# EAGLE design Ram_Upgrade (EAGLE 6.4)
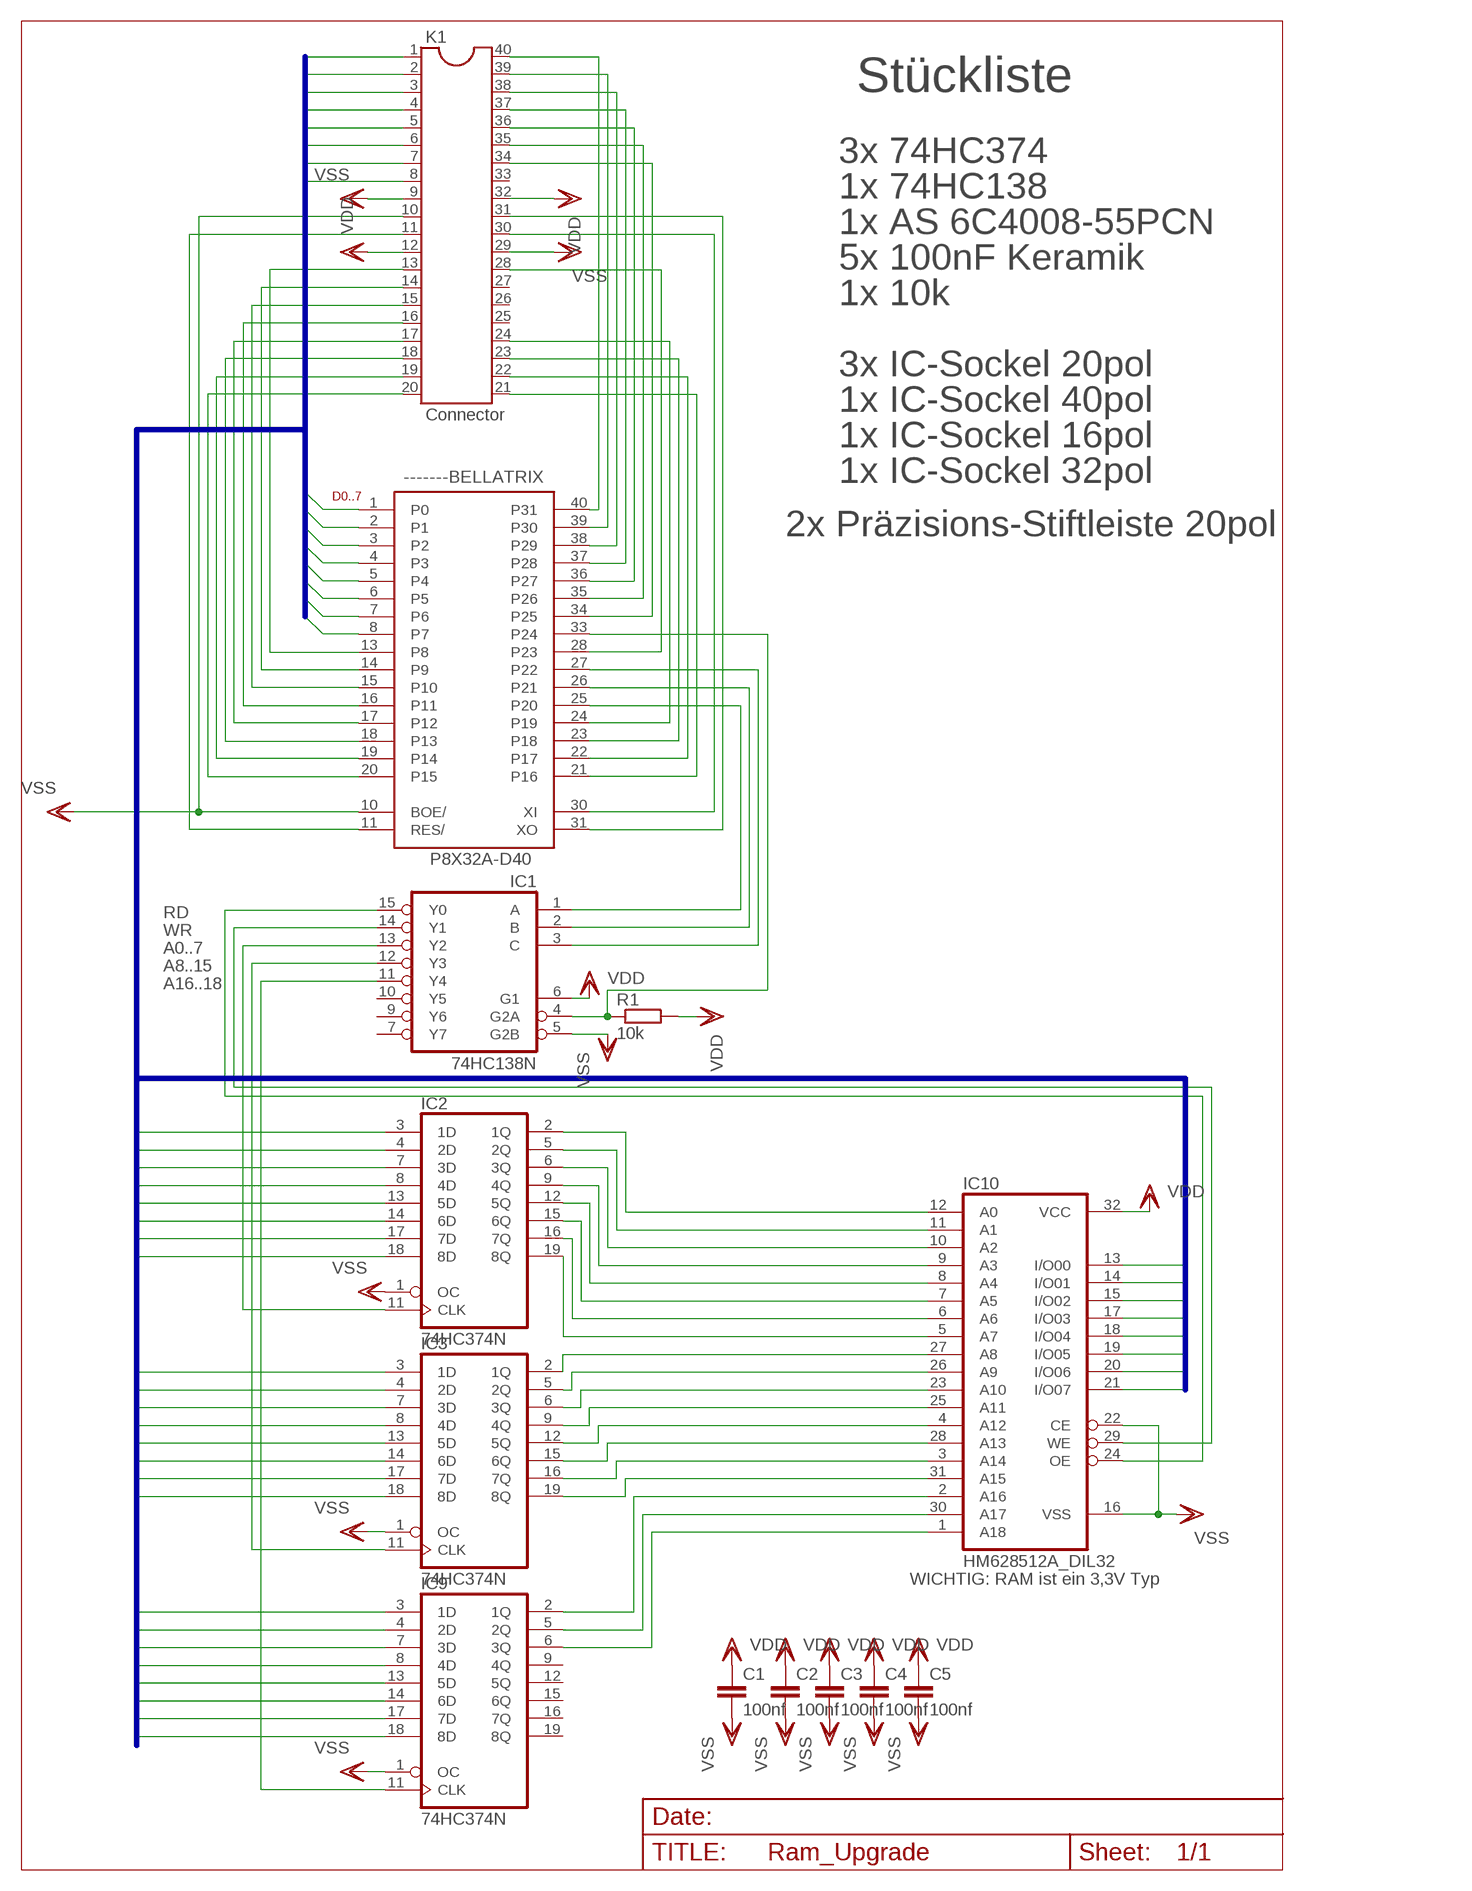
[diagram p0: schematic, sheet 1]

## Parts
-------BELLATRIX  P8X32A-D40  [P8X32A-D40]
C1  100nf  C-EU075-032X103  [C075-032X103]
C2  100nf  C-EU075-032X103  [C075-032X103]
C3  100nf  C-EU075-032X103  [C075-032X103]
C4  100nf  C-EU075-032X103  [C075-032X103]
C5  100nf  C-EU075-032X103  [C075-032X103]
IC1  74HC138N  [DIL16]
IC2  74HC374N  [DIL20]
IC3  74HC374N  [DIL20]
IC9  74HC374N  [DIL20]
IC10  HM628512A_DIL32  [DIL32]
K1  Connector  DIL40  [DIL40]
R1  10k  R-EU_0207/10  [0207/10]

## Nets
BUSCLK: -------BELLATRIX.34(P25) K1.34
D0: -------BELLATRIX.1(P0) IC2.3(1D) IC3.3(1D) IC9.3(1D) IC10.13(I/O00) K1.1
D1: -------BELLATRIX.2(P1) IC2.4(2D) IC3.4(2D) IC9.4(2D) IC10.14(I/O01) K1.2
D2: -------BELLATRIX.3(P2) IC2.7(3D) IC3.7(3D) IC9.7(3D) IC10.15(I/O02) K1.3
D3: -------BELLATRIX.4(P3) IC2.8(4D) IC3.8(4D) IC9.8(4D) IC10.17(I/O03) K1.4
D4: -------BELLATRIX.5(P4) IC2.13(5D) IC3.13(5D) IC9.13(5D) IC10.18(I/O04) K1.5
D5: -------BELLATRIX.6(P5) IC2.14(6D) IC3.14(6D) IC9.14(6D) IC10.19(I/O05) K1.6
D6: -------BELLATRIX.7(P6) IC2.17(7D) IC3.17(7D) IC9.17(7D) IC10.20(I/O06) K1.7
D7: -------BELLATRIX.8(P7) IC2.18(8D) IC3.18(8D) IC9.18(8D) IC10.21(I/O07) K1.8
GLOB_RESET: -------BELLATRIX.11(RES/) K1.11
N$1: -------BELLATRIX.33(P24) IC1.4(G2A) R1.1
N$2: -------BELLATRIX.28(P23) K1.28
N$3: -------BELLATRIX.24(P19) K1.24
N$4: IC1.13(Y2) IC2.11(CLK)
N$5: -------BELLATRIX.23(P18) K1.23
N$6: IC1.12(Y3) IC3.11(CLK)
N$7: IC1.11(Y4) IC9.11(CLK)
N$8: IC2.2(1Q) IC10.12(A0)
N$9: IC2.5(2Q) IC10.11(A1)
N$10: IC2.6(3Q) IC10.10(A2)
N$11: IC2.9(4Q) IC10.9(A3)
N$12: IC2.12(5Q) IC10.8(A4)
N$13: -------BELLATRIX.22(P17) K1.22
N$14: IC2.15(6Q) IC10.7(A5)
N$15: IC2.16(7Q) IC10.6(A6)
N$16: IC2.19(8Q) IC10.5(A7)
N$17: -------BELLATRIX.21(P16) K1.21
N$18: IC3.2(1Q) IC10.27(A8)
N$19: IC3.5(2Q) IC10.26(A9)
N$20: IC3.6(3Q) IC10.23(A10)
N$21: -------BELLATRIX.13(P8) K1.13
N$22: -------BELLATRIX.31(XO) K1.31
N$23: -------BELLATRIX.14(P9) K1.14
N$24: -------BELLATRIX.15(P10) K1.15
N$25: IC1.14(Y1) IC10.29(WE)
N$26: IC3.9(4Q) IC10.25(A11)
N$27: IC3.12(5Q) IC10.4(A12)
N$28: -------BELLATRIX.37(P28) K1.37
N$29: -------BELLATRIX.38(P29) K1.38
N$30: -------BELLATRIX.16(P11) K1.16
N$31: -------BELLATRIX.17(P12) K1.17
N$32: -------BELLATRIX.30(XI) K1.30
N$33: -------BELLATRIX.18(P13) K1.18
N$34: -------BELLATRIX.19(P14) K1.19
N$35: -------BELLATRIX.20(P15) K1.20
N$42: IC3.15(6Q) IC10.28(A13)
N$43: IC3.16(7Q) IC10.3(A14)
N$44: IC3.19(8Q) IC10.31(A15)
N$45: IC9.2(1Q) IC10.2(A16)
N$50: IC9.5(2Q) IC10.30(A17)
N$51: IC9.6(3Q) IC10.1(A18)
N$55: -------BELLATRIX.36(P27) K1.36
N$59: IC1.15(Y0) IC10.24(OE)
N$64 [AudioVideo]: -------BELLATRIX.25(P20) IC1.1(A)
N$68 [AudioVideo]: -------BELLATRIX.26(P21) IC1.2(B)
N$70 [AudioVideo]: -------BELLATRIX.27(P22) IC1.3(C)
RX-H1: -------BELLATRIX.40(P31) K1.40
TX-H1: -------BELLATRIX.39(P30) K1.39
VDD [Power]: C1.1 C2.1 C3.1 C4.1 C5.1 IC1.6(G1) IC10.32(VCC) K1.12 K1.32 R1.2
VSS [Power]: -------BELLATRIX.10(BOE/) C1.2 C2.2 C3.2 C4.2 C5.2 IC1.5(G2B) IC2.1(OC) IC3.1(OC) IC9.1(OC) IC10.16(VSS) IC10.22(CE) K1.9 K1.10 K1.29
WR: -------BELLATRIX.35(P26) K1.35
Unconnected: IC1.7(Y7) IC1.9(Y6) IC1.10(Y5) IC9.9(4Q) IC9.12(5Q) IC9.15(6Q) IC9.16(7Q) IC9.19(8Q) K1.25 K1.26 K1.27 K1.33

## Buses
D[0..7]

## Notes on the sheet
- Stückliste
- 3x 74HC374
- 1x 74HC138
- 1x AS 6C4008-55PCN
- 5x 100nF Keramik
- 1x 10k
- 3x IC-Sockel 20pol
- 1x IC-Sockel 40pol
- 1x IC-Sockel 16pol
- 1x IC-Sockel 32pol
- D0..7
- 2x Präzisions-Stiftleiste 20pol
- RD
- WR
- A0..7
- A8..15
- A16..18
- WICHTIG: RAM ist ein 3,3V Typ

## Power pins joined to a net without a drawn wire
VDD: -------BELLATRIX.12(VDD) -------BELLATRIX.32(VDD) IC1.16(VDD) IC2.20(VDD) IC3.20(VDD) IC9.20(VDD)
VSS: -------BELLATRIX.9(VSS) -------BELLATRIX.29(VSS) IC1.8(GND) IC2.10(GND) IC3.10(GND) IC9.10(GND)

## Library data of the parts
-------BELLATRIX = parallax_propeller:P8X32A-D40
C1-C5 = rcl:C-EU: CAPACITOR, European symbol
IC1 = 74xx-eu:74*138: 3-line to 8-line DECODER/DEMULTIPLEXER
IC2 IC3 IC9 = 74xx-eu:74*374: Octal D type transparent LATCH, edge triggered
IC10 = hitachi_sram_hm628512a-series_rev1:HM628512A_DIL32: 4M SRAM 512kword x 8bit
K1 = ic-package:DIL40: Dual In Line
R1 = rcl:R-EU_: RESISTOR, European symbol

## Net classes
0 default: width 0.254 mm, clearance 0.254 mm
1 Power: width 0.635 mm, drill 0.61 mm, clearance 0.381 mm
2 AudioVideo: width 0.254 mm, clearance 0.254 mm
3 Priority: width 0.279 mm, clearance 0.279 mm

## Board
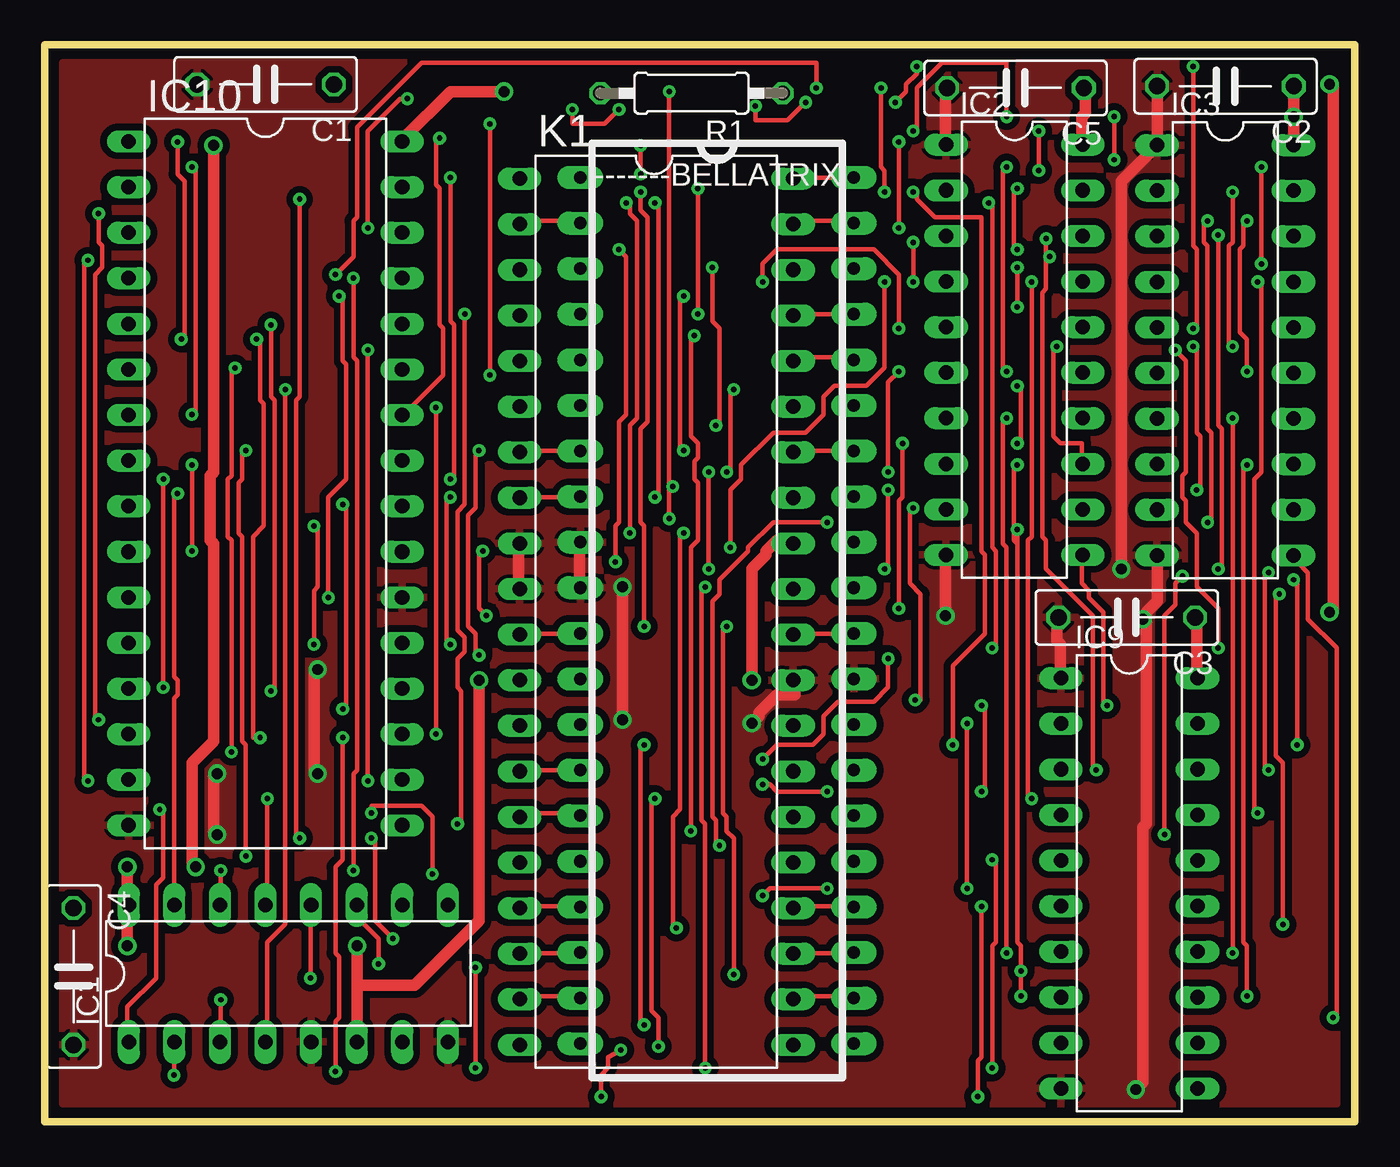
[diagram p1: board, top side]
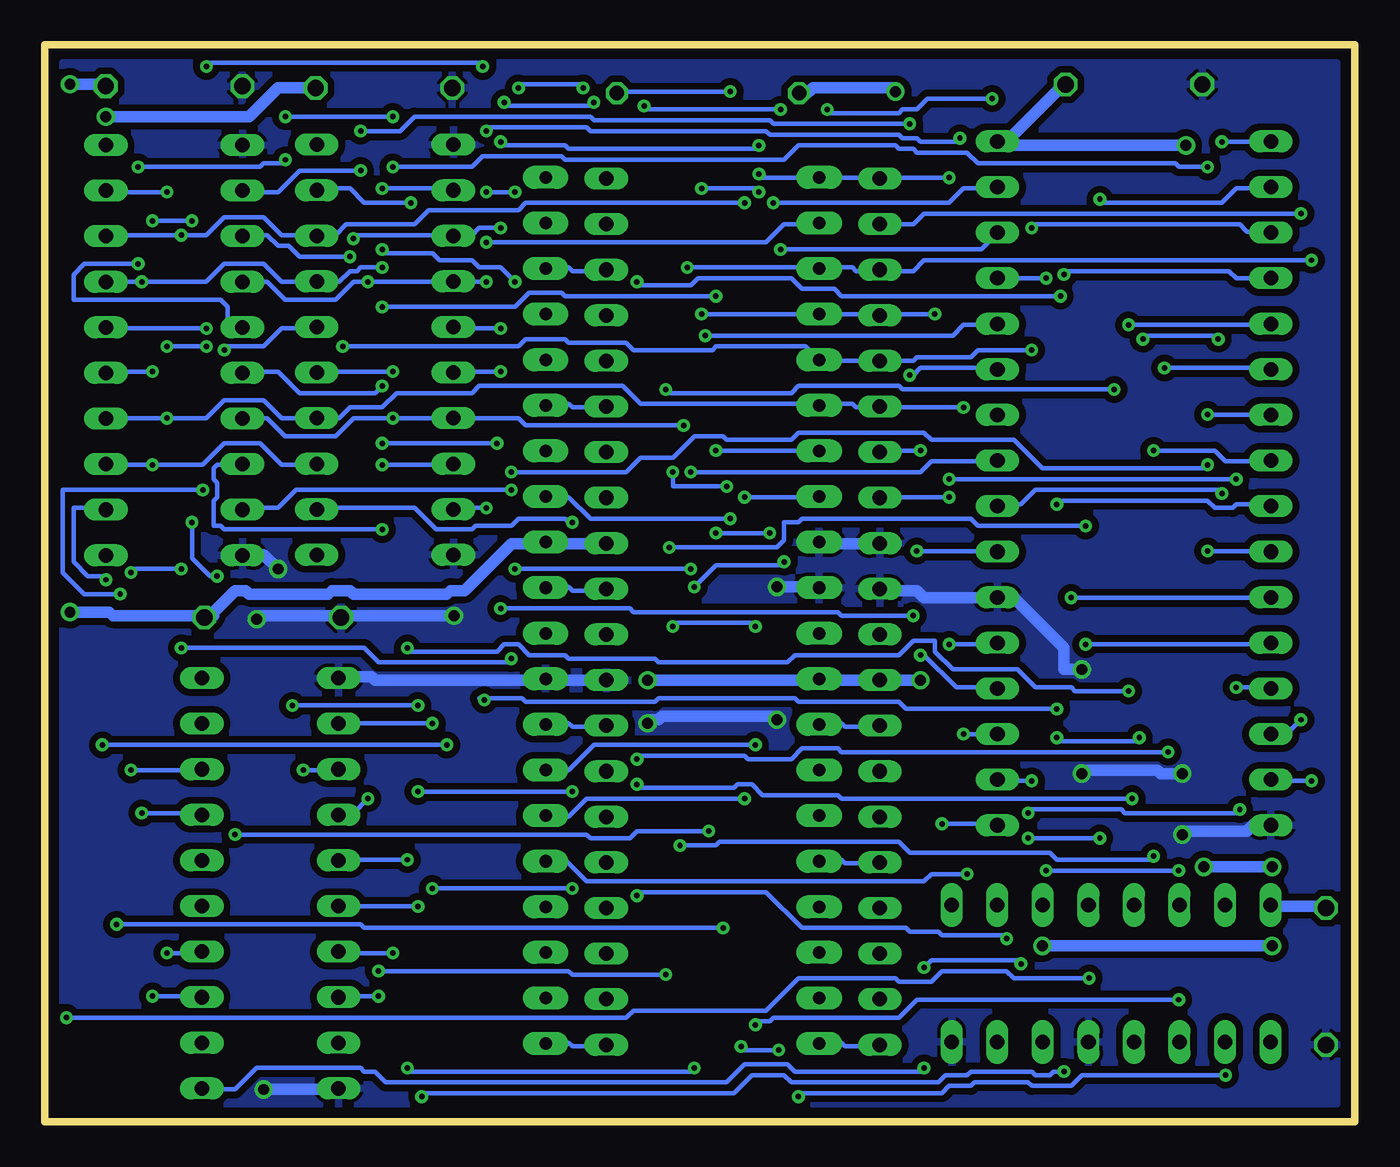
[diagram p2: board, bottom side, seen from below]

Size 73 x 60 mm. Coordinates in mm from the lower left corner, seen from the top.
Outline: 0,0 0,60 73,60 73,0 0,0
Copper layers (1*16): Top 0.035mm / dielectric 1.5mm / Bottom 0.035mm
Design rules "PCB-POOL": minimum track width 6mil, minimum drill 12mil, track to track 6mil, track to pad 6mil, pad to pad 6mil, via to via 6mil, smd to smd 6mil, copper to edge 20mil, drill to drill 8mil, minimum pad ring 8mil, minimum via ring 8mil, stop-mask expansion 3mil, vias tented up to drill 24mil, thermal gap 8mil

### Footprints (pad centres in the part's own frame; a part is rotated, then mirrored left to right if it is on the bottom)
P8X32A-D40 = drill 0.7 pad 1.27 long: 1 -7.62,23.495; 2 -7.62,20.955; 3 -7.62,18.415; 4 -7.62,15.875; 5 -7.62,13.335; 6 -7.62,10.795; 7 -7.62,8.255; 8 -7.62,5.715; 9 -7.62,3.175; 10 -7.62,0.635; 11 -7.62,-1.905; 12 -7.62,-4.445; 13 -7.62,-6.985; 14 -7.62,-9.525; 15 -7.62,-12.065; 16 -7.62,-14.605; 17 -7.62,-17.145; 18 -7.62,-19.685; 19 -7.62,-22.225; 20 -7.62,-24.765; 21 7.62,-24.765; 22 7.62,-22.225; 23 7.62,-19.685; 24 7.62,-17.145; 25 7.62,-14.605; 26 7.62,-12.065; 27 7.62,-9.525; 28 7.62,-6.985; 29 7.62,-4.445; 30 7.62,-1.905; 31 7.62,0.635; 32 7.62,3.175; 33 7.62,5.715; 34 7.62,8.255; 35 7.62,10.795; 36 7.62,13.335; 37 7.62,15.875; 38 7.62,18.415; 39 7.62,20.955; 40 7.62,23.495
C075-032X103 = drill 0.914 octagon: 1 -3.81,0; 2 3.81,0
DIL16 = drill 0.813 long: 1 -8.89,-3.81; 2 -6.35,-3.81; 3 -3.81,-3.81; 4 -1.27,-3.81; 5 1.27,-3.81; 6 3.81,-3.81; 7 6.35,-3.81; 8 8.89,-3.81; 9 8.89,3.81; 10 6.35,3.81; 11 3.81,3.81; 12 1.27,3.81; 13 -1.27,3.81; 14 -3.81,3.81; 15 -6.35,3.81; 16 -8.89,3.81
DIL20 = drill 0.813 long: 1 -11.43,-3.81; 2 -8.89,-3.81; 3 -6.35,-3.81; 4 -3.81,-3.81; 5 -1.27,-3.81; 6 1.27,-3.81; 7 3.81,-3.81; 8 6.35,-3.81; 9 8.89,-3.81; 10 11.43,-3.81; 11 11.43,3.81; 12 8.89,3.81; 13 6.35,3.81; 14 3.81,3.81; 15 1.27,3.81; 16 -1.27,3.81; 17 -3.81,3.81; 18 -6.35,3.81; 19 -8.89,3.81; 20 -11.43,3.81
DIL32 = drill 0.813 long: 1 -17.78,-7.62; 2 -15.24,-7.62; 3 -12.7,-7.62; 4 -10.16,-7.62; 5 -7.62,-7.62; 6 -5.08,-7.62; 7 -2.54,-7.62; 8 0,-7.62; 9 2.54,-7.62; 10 5.08,-7.62; 11 7.62,-7.62; 12 10.16,-7.62; 13 12.7,-7.62; 14 15.24,-7.62; 15 17.78,-7.62; 16 20.32,-7.62; 17 20.32,7.62; 18 17.78,7.62; 19 15.24,7.62; 20 12.7,7.62; 21 10.16,7.62; 22 7.62,7.62; 23 5.08,7.62; 24 2.54,7.62; 25 0,7.62; 26 -2.54,7.62; 27 -5.08,7.62; 28 -7.62,7.62; 29 -10.16,7.62; 30 -12.7,7.62; 31 -15.24,7.62; 32 -17.78,7.62
DIL40 = drill 0.813 long: 1 -24.13,-7.62; 2 -21.59,-7.62; 3 -19.05,-7.62; 4 -16.51,-7.62; 5 -13.97,-7.62; 6 -11.43,-7.62; 7 -8.89,-7.62; 8 -6.35,-7.62; 9 -3.81,-7.62; 10 -1.27,-7.62; 11 1.27,-7.62; 12 3.81,-7.62; 13 6.35,-7.62; 14 8.89,-7.62; 15 11.43,-7.62; 16 13.97,-7.62; 17 16.51,-7.62; 18 19.05,-7.62; 19 21.59,-7.62; 20 24.13,-7.62; 21 24.13,7.62; 22 21.59,7.62; 23 19.05,7.62; 24 16.51,7.62; 25 13.97,7.62; 26 11.43,7.62; 27 8.89,7.62; 28 6.35,7.62; 29 3.81,7.62; 30 1.27,7.62; 31 -1.27,7.62; 32 -3.81,7.62; 33 -6.35,7.62; 34 -8.89,7.62; 35 -11.43,7.62; 36 -13.97,7.62; 37 -16.51,7.62; 38 -19.05,7.62; 39 -21.59,7.62; 40 -24.13,7.62
0207/10 = drill 0.813 octagon: 1 -5.08,0; 2 5.08,0

### Placement (x,y rotation side)
-------BELLATRIX  37.47,29.12 0 top
C1  12.3,57.8 180 top
C2  65.8,57.7 180 top
C3  60.3,28.1 180 top
C4  1.6,8.1 270 top
C5  54.1,57.6 180 top
IC1  13.57,8.26 0 top
IC2  54.04,43.01 270 top
IC3  65.79,42.99 270 top
IC9  60.44,13.29 270 top
IC10  12.29,36.84 270 top
K1  34.08,28.42 270 top
R1  36.04,57.31 180 top

### Tracks (layer width: path | path; a pad name or v marks a point on that pad's centre or on a via)
BUSCLK
  Top 0.254: -------BELLATRIX.34 45,37.4 41.8,37.4 K1.34
D0  (via drill 0.3)
  Top 0.254: v58.6,19.6 58.4,19.8 58.4,28.2 55.8,30.8 55.8,32.4 55.6,32.6 55.6,46.2 55.8,46.4 55.8,48.2 | v55.8,49.2 55.8,48.2 | 55.8,48.2 v56,48.2 | v6.6,35.8 v6.6,24.2 | v22.6,35.8 22.8,36 22.8,44.4 22.6,44.6 v22.6,52.6 | v47.6,54.6 v47.6,49.8 | v33.2,52.8 v33.2,54.4
  Bottom 0.254: v58.6,19.6 56.8,19.6 IC9.3 | v55.8,49.2 55.6,49.4 50.4,49.4 IC2.3 50.2,49.4 49.2,49.4 48.8,49.8 v47.6,49.8 | v56,48.2 58.8,48.2 59.4,48.8 60,48.8 60.6,49.4 61.8,49.4 IC3.3 | v6.6,24.2 4.8,24.2 IC10.13 | v22.6,35.8 v6.6,35.8 | v22.6,52.6 26.4,52.6 K1.1 26.6,52.6 29.8,52.6 -------BELLATRIX.1 30,52.6 33,52.6 v33.2,52.8 | v47.6,54.6 47.4,54.4 44,54.4 43.8,54.2 33.4,54.2 v33.2,54.4
D1  (via drill 0.3)
  Top 0.254: v55,18 54.8,18.2 54.8,32.4 55,32.6 v55,46.8 | -------BELLATRIX.2 29.8,50.2 26.6,50.2 K1.2 | v3,22.4 2.8,22.6 2.8,47.2 3.2,47.6 3.2,48.8 3,49 v3,50.6 | v48.4,49 v48.4,46.8
  Bottom 0.254: IC3.4 60.6,46.8 59.6,45.8 56.8,45.8 55.8,46.8 v55,46.8 50.4,46.8 IC2.4 50.2,46.8 v48.4,46.8 | v55,18 55.8,17.2 56.6,17.2 IC9.4 | IC10.14 3.8,21.6 v3,22.4 | v3,50.6 24,50.6 24.6,50 26.4,50 K1.2 | v48.4,49 32.8,49 31.8,50 30,50 -------BELLATRIX.2
D2  (via drill 0.3)
  Top 0.254: v53.6,9.4 53.6,32 53.4,32.2 53.4,39 v53.6,39.2 | v2.4,19 2.2,19.2 2.2,47.8 v2.4,48 | v37.4,38.8 37.6,39 37.6,44.2 37.2,44.6 v37.2,47.6
  Bottom 0.254: IC3.7 61.8,39.2 60.6,39.2 59.6,38.2 56.8,38.2 55.8,39.2 v53.6,39.2 IC2.7 46.6,39.2 46.2,38.8 v37.4,38.8 | v53.6,9.4 56.6,9.4 IC9.7 | v2.4,19 4.6,19 IC10.15 | v2.4,48 24,48 24.6,47.4 26.4,47.4 K1.3 26.6,47.4 27.8,47.4 28,47.6 29.8,47.6 -------BELLATRIX.3 30,47.6 v37.2,47.6
D3  (via drill 0.3)
  Top 0.254: v23,16.6 23.2,16.8 23.2,24 23,24.2 23,25.8 23.4,26.2 23.4,27 23,27.4 23,34 23.4,34.4 v23.4,45 | v54.4,7 v54.4,8.4 54.4,9.8 54.2,10 54.2,32.2 | 54.2,32.2 54,32.4 54,36.4 v54.2,36.6 | 54.2,32.2 v54.2,33 | v36.4,52 v36.4,45 | v33.2,51.8 33.2,50.8 33.6,50.4 33.6,39 33.2,38.6 33.2,33.4 33.4,33.2 v33.4,27.6 | v38,27.6 37.8,27.4 37.8,17.2 38,17 38,16.2 38.4,15.8 v38.4,8.2
  Bottom 0.254: v23,16.6 20,16.6 IC10.17 | v23.4,45 26.4,45 K1.4 26.6,45 29.8,45 -------BELLATRIX.4 30,45 v36.4,45 | v54.4,7 56.6,7 IC9.8 | v54.2,36.6 50.4,36.6 IC2.8 | v54.2,33 63,33 63.2,33.2 63.6,33.2 63.6,34.6 63.4,34.8 63.4,35.6 63.6,35.8 63.6,36.4 63.4,36.6 62,36.6 IC3.8 | v36.4,52 33.4,52 v33.2,51.8 | v33.4,27.6 33.6,27.8 37.8,27.8 v38,27.6 | v38.4,8.2 43.6,8.2 43.8,8.4 v54.4,8.4
D4  (via drill 0.3)
  Top 0.254: v18,43 v18,19 | v67,7 67,9.8 66.8,10 66.8,36.4 v67,36.6 | v56.4,43.2 56.2,43 56.2,38.2 56.6,37.8 57.8,37.8 57.8,36.8 IC2.13
  Bottom 0.254: v18,19 19.8,19 IC10.18 | v18,43 21,43 21.4,42.6 24.4,42.6 24.6,42.4 26.4,42.4 K1.5 26.6,42.4 29.8,42.4 -------BELLATRIX.5 30,42.6 30.6,43.2 35.6,43.2 35.8,43 40.2,43 40.6,43.4 43.8,43.4 44,43.6 46.2,43.6 46.6,43.2 v56.4,43.2 | IC2.13 58,36.6 59.8,36.6 61,37.8 63,37.8 64.2,36.6 v67,36.6 69.6,36.6 IC3.13 | v67,7 64.4,7 IC9.13
D5  (via drill 0.3)
  Top 0.254: v21.8,39.8 v21.8,21.6 | v66.2,39.2 v66.2,9.4
  Bottom 0.254: v21.8,21.6 IC10.19 | v21.8,39.8 26.4,39.8 K1.6 26.6,39.8 27.8,39.8 28,40 29.8,40 -------BELLATRIX.6 30,40 39.8,40 40.8,41 48.8,41 49.2,40.6 53.4,40.6 54.2,39.8 56,39.8 56.6,39.2 IC2.14 59.8,39.2 60.8,40.2 63,40.2 64,39.2 v66.2,39.2 69.6,39.2 IC3.14 | v66.2,9.4 64.4,9.4 IC9.14
D6  (via drill 0.3)
  Top 0.254: -------BELLATRIX.7 29.8,37.4 26.6,37.4 K1.7 | v24.2,26 24,26.2 24,27.2 23.6,27.6 23.6,33.8 24,34.2 24,37.2 v24.2,37.4 | v67.6,17.2 67.4,17.4 67.4,35.8 67.8,36.2 67.8,46.6 v67.6,46.8 | v35.6,37.4 35.4,37.6 35.4,45.8 v35.6,46 | v54.2,47.6 v54.2,45.4
  Bottom 0.254: v24.2,26 24,26 22.2,24.2 20,24.2 IC10.20 | v24.2,37.4 26.4,37.4 K1.7 | IC3.17 v67.6,46.8 64,46.8 63,47.8 60.8,47.8 59.8,46.8 58,46.8 IC2.17 57.8,46.8 56.6,46.8 56,47.4 55.6,47.4 55.4,47.6 v54.2,47.6 | v67.6,17.2 64.4,17.2 IC9.17 | v35.6,37.4 30,37.4 -------BELLATRIX.7 | v35.6,46 44,46 44.2,46.2 46,46.2 46.8,45.4 v54.2,45.4
D7  (via drill 0.3)
  Top 0.254: -------BELLATRIX.8 29.8,34.8 26.6,34.8 K1.8 | v22.6,26.6 22.4,26.8 22.4,34.6 v22.6,34.8 | v68.2,19.6 68,19.8 68,30.4 v68.2,30.6 | v65.4,30.8 65.6,31 65.6,38.6 65.4,38.8 v65.4,49.4 | v34,34.8 34.2,35 34.2,51 v34,51.2
  Bottom 0.254: v22.6,26.6 20,26.6 IC10.21 | v22.6,34.8 26.4,34.8 K1.8 | IC3.18 69.6,49.4 v65.4,49.4 64,49.4 63,50.4 60.8,50.4 59.8,49.4 58,49.4 IC2.18 57.8,49.4 56.8,49.4 56.2,50 52.4,50 51.6,50.8 46.6,50.8 46.2,51.2 v34,51.2 | v68.2,19.6 64.4,19.6 IC9.18 | v68.2,30.6 68,30.8 v65.4,30.8 | v34,34.8 30,34.8 -------BELLATRIX.8
GLOB_RESET
  Top 0.254: -------BELLATRIX.11 29.8,27.2 26.6,27.2 K1.11
N$1  (via drill 0.3)
  Top 0.254: v34.8,57.4 34.8,35.4 | 34.8,35.4 v34.8,33.6 | v13.4,40.8 13.4,11 12.4,10 12.4,4.6 IC1.4 | v38.4,40.8 38.2,40.6 38.2,36.4 v38,36.2 | 34.8,35.4 v35,35.4
  Bottom 0.254: v34.8,33.6 42.6,33.6 43.8,34.8 45,34.8 -------BELLATRIX.33 | v34.8,57.4 41,57.4 R1.1 | v13.4,40.8 25.2,40.8 25.4,41 31,41 31.4,40.6 38.2,40.6 v38.4,40.8 | v38,36.2 38,35.4 v35,35.4
N$2
  Bottom 0.254: K1.28 41.8,22 43.6,22 43.8,22.2 45,22.2 -------BELLATRIX.28
N$3
  Top 0.254: -------BELLATRIX.24 45,12 41.8,12 K1.24
N$4  (via drill 0.3)
  Top 0.254: v12.4,18 12.4,12.2 IC1.13 | v40,18.8 40.4,18.8 40.8,18.4 v43.6,18.4 | v52.2,18.4 52.4,18.6 52.4,23 v52.2,23.2 | v59.2,23.2 59,23.4 59,28.4 58.2,29.2 58.2,29.6 57.8,30 57.8,31.4 IC2.11
  Bottom 0.254: v12.4,18 28.6,18 28.8,18.2 33,18.2 33.6,18.8 34.4,18.8 34.6,18.6 39.8,18.6 v40,18.8 | v52.2,18.4 v43.6,18.4 | v59.2,23.2 v52.2,23.2
N$5
  Top 0.254: -------BELLATRIX.23 45,9.4 41.8,9.4 K1.23
N$6  (via drill 0.3)
  Top 0.254: v14.8,8 14.8,12 IC1.12 | v71.8,5.8 72,6 72,26.4 70.4,28 70.4,30.6 69.8,31.2 69.6,31.2 IC3.11
  Bottom 0.254: v14.8,8 19,8 19.4,8.4 23,8.4 23.6,7.8 25.4,7.8 25.6,8 31,8 32.8,6.2 40.2,6.2 40.6,5.8 v71.8,5.8
N$7  (via drill 0.3)
  Top 0.254: v18.6,8.8 18.6,10.2 17.4,11.4 17.4,12 IC1.11 | v24,3 v24,8.6
  Bottom 0.254: v18.6,8.8 18.8,9 23.6,9 v24,8.6 | v24,3 24.2,2.8 31.2,2.8 31.6,3.2 34,3.2 35,2.2 54,2.2 54.6,2.8 55.2,2.8 55.4,3 61.2,3 62.4,1.8 64.2,1.8 IC9.11
N$8  (via drill 0.3)
  Top 0.254: v54.2,52 54,51.8 54,48.8 v54.2,48.6 | v46.8,46.8 46.8,42 45.8,41 44,41 43.4,40.4 43.4,39.4 42.4,38.4 40.6,38.4 38.8,36.6 38.8,35.8 38.2,35.2 v38.2,32 | v15,33.2 15.2,33 15.2,29.8 15,29.6 v15,26.6
  Bottom 0.254: v54.2,52 50.4,52 IC2.2 | v54.2,48.6 54,48.4 51.4,48.4 51,48 49.2,48 48.8,47.6 47.6,47.6 v46.8,46.8 | v38.2,32 32.2,32 31.8,32.4 31.8,33.4 31,33.4 30.8,33.6 21.4,33.6 21,33.2 v15,33.2 | v15,26.6 4.8,26.6 IC10.12
N$9  (via drill 0.3)
  Top 0.254: v15.8,29.2 15.8,34.8 16.8,35.8 16.8,42.2 16.6,42.4 16.6,45.8 v16.4,46 | v40,46.8 40,47.8 40.8,48.6 46.2,48.6 47.6,47.2 v47.6,44.2
  Bottom 0.254: v15.8,29.2 4.8,29.2 IC10.11 | v16.4,46 28.6,46 29,46.4 30.8,46.4 31.4,47 36.6,47 37,46.6 39.8,46.6 v40,46.8 | v47.6,44.2 50.2,44.2 IC2.5
N$10  (via drill 0.3)
  Top 0.254: v8.2,36.6 v8.2,31.8 | v47,36.2 47,41.2 v47.6,41.8
  Bottom 0.254: v8.2,31.8 4.8,31.8 IC10.10 | v8.2,36.6 8.4,36.4 17.4,36.4 19,38 23.6,38 24,38.4 31,38.4 31.4,38 35,38 35.2,38.2 36.8,38.2 38,37 39.8,37 40.6,36.2 v47,36.2 | v47.6,41.8 50.2,41.8 IC2.6
N$11  (via drill 0.3)
  Top 0.254: v48.4,34.2 48.2,34 48.2,30 48.8,29.4 48.8,23.5 v48.5,23.5 | v16.6,23 16.8,23.2 16.8,34.2 v16.6,34.4
  Bottom 0.254: v48.4,34.2 50.2,34.2 IC2.9 | v48.5,23.5 48.8,23.6 46.4,23.6 46.2,23.4 39,23.4 38.8,23.6 31.2,23.6 31,23.4 25.4,23.4 25,23 v16.6,23 | v16.6,34.4 16.4,34.6 8.2,34.6 7.8,34.2 6.8,34.2 6.6,34.4 4.8,34.4 IC10.9
N$12  (via drill 0.3)
  Top 0.254: v11.2,37.4 11,37.2 11,35.8 10.8,35.6 10.8,32.8 11,32.6 11,21.2 11.2,21 v11.2,14.8 | v37.6,15.4 37.4,15.6 37.4,16.8 37.2,17 37.2,29 37.6,29.4 37.6,30.2 39.2,31.8 39.2,32 40.6,33.4 v43.6,33.4
  Bottom 0.254: v11.2,37.4 7.8,37.4 7.2,36.8 4.8,36.8 IC10.8 | v11.2,14.8 11.4,14.6 16.6,14.6 17,15 24.8,15 25.4,15.6 35.4,15.6 35.6,15.4 v37.6,15.4 | v43.6,33.4 43.8,33.4 44,33.6 46.6,33.6 47,33.2 49,33.2 49.2,33 51.2,33 52.4,34.2 57.8,34.2 IC2.12
N$13
  Top 0.254: -------BELLATRIX.22 45,7 41.8,7 K1.22
N$14  (via drill 0.3)
  Top 0.254: v8.2,39.4 8.4,39.6 8.4,53 v8.2,53.2 | v53.6,53.2 53.4,53 53.4,42 v53.6,41.8
  Bottom 0.254: v8.2,39.4 4.8,39.4 IC10.7 | v8.2,53.2 9.8,53.2 10,53.4 21,53.4 21.6,54 24.4,54 24.6,54.2 25.4,54.2 25.6,54.4 31,54.4 31.8,53.6 44,53.6 44.2,53.8 48.6,53.8 49.2,53.2 v53.6,53.2 | v53.6,41.8 57.8,41.8 IC2.15
N$15  (via drill 0.3)
  Top 0.254: v10.6,42 10.4,41.8 10.4,36 10.2,35.8 10.2,32.6 10.4,32.4 v10.4,20.6 | v40,20.2 40.8,21 42.8,21 43.4,21.6 43.4,22.6 44.2,23.4 46.2,23.4 47,24.2 v47,25.8 | v65.4,26.4 65.4,28.6 64.2,29.8 64.2,32.8 63.6,33.4 63.6,34.6 63.4,34.8 63.4,36 63.6,36.2 63.6,42.4 v63,43
  Bottom 0.254: v10.6,42 4.8,42 IC10.6 | v10.4,20.6 28.6,20.6 28.8,20.8 30.8,20.8 31.4,20.2 33.8,20.2 34,20.4 39.8,20.4 v40,20.2 | v47,25.8 47.2,25.6 54.4,25.6 55.2,26.4 v65.4,26.4 | v63,43 62.8,43.2 60.8,43.2 59.8,44.2 58,44.2 IC2.16
N$16  (via drill 0.3)
  Top 0.254: v12.6,44.4 12.6,40.4 12.8,40.2 12.8,24.2 v12.6,24 | v52.8,26.4 53,26.6 53,31.8 52.8,32 52.8,51 v52.6,51.2
  Bottom 0.254: v12.6,44.4 4.8,44.4 IC10.5 | v12.6,24 15.6,24 15.8,24.2 17.8,24.2 18.8,25.2 22.4,25.2 23.4,26.2 23.4,26.8 24.6,26.8 25.4,26 31.2,26 31.6,25.6 38.8,25.6 39,25.8 43.8,25.8 44,26 46,26 46.6,26.6 47.4,26.6 47.8,26.2 52.6,26.2 v52.8,26.4 | v52.6,51.2 55.2,51.2 56,52 57.8,52 IC2.19
N$17
  Bottom 0.254: K1.21 41.8,4.2 43.6,4.2 43.8,4.4 45,4.4 -------BELLATRIX.21
N$18  (via drill 0.3)
  Top 0.254: v24.8,55.6 v24.8,41.6 | v55.4,53 v55.4,55.2
  Bottom 0.254: v24.8,41.6 24.6,41.6 24.2,42 20,42 IC10.27 | v24.8,55.6 32.4,55.6 32.6,55.8 42.4,55.8 42.6,56 52.4,56 53.2,55.2 v55.4,55.2 | v55.4,53 58.8,53 60,51.8 61.8,51.8 IC3.2
N$19  (via drill 0.3)
  Top 0.254: v22,54.8 21.8,54.6 21.8,52.2 22,52 22,44.4 22.2,44.2 22.2,41.6 20,39.4 IC10.26 | v48.4,55.2 48.6,55.4 48.6,57.6 50,59 53.6,59 v53.6,56 | v59.6,53.6 v59.6,56 | v67.8,47.8 v67.8,53.2
  Bottom 0.254: v22,54.8 22.2,54.6 24.2,54.6 24.4,54.8 25.2,54.8 25.4,55 32.6,55 32.8,55.2 42.6,55.2 42.8,55.4 48.2,55.4 v48.4,55.2 | v59.6,56 v53.6,56 | v59.6,53.6 59.8,53.4 60.8,53.4 61,53.2 v67.8,53.2 | v67.8,47.8 70.8,47.8 71.4,47.2 71.4,45.8 63.2,45.8 62.8,45.4 62.8,44.2 62,44.2 IC3.5
N$20  (via drill 0.3)
  Top 0.254: v24.4,31.8 24.2,31.6 24.2,28.6 v24.6,28.2 | v47.6,28.6 47.6,34.6 47.8,34.8 v47.8,37.8 | v54.2,37.8 54.4,38 54.4,40.8 v54.2,41
  Bottom 0.254: v24.4,31.8 20,31.8 IC10.23 | v24.6,28.2 28.6,28.2 28.8,28.4 40.2,28.4 40.4,28.6 v47.6,28.6 | v54.2,37.8 v47.8,37.8 | v54.2,41 54.6,40.6 58.8,40.6 60,41.8 61.8,41.8 IC3.6
N$21
  Bottom 0.254: K1.13 26.6,22 28.4,22 28.6,22.2 29.8,22.2 -------BELLATRIX.13
N$22
  Bottom 0.254: K1.31 41.8,29.6 43.6,29.6 43.8,29.8 45,29.8 -------BELLATRIX.31
N$23
  Top 0.254: -------BELLATRIX.14 29.8,19.6 26.6,19.6 K1.14
N$24
  Top 0.254: -------BELLATRIX.15 29.8,17.2 26.4,17.2 26.4,17 K1.15
N$25  (via drill 0.3)
  Top 0.254: v9.8,14 9.8,12.2 IC1.14 | v17.2,14 17.2,19.4 17.4,19.6 17.4,42.4 17.2,42.6 v17.2,47
  Bottom 0.254: v17.2,14 v9.8,14 | IC10.29 v17.2,47
N$26  (via drill 0.3)
  Top 0.254: v37,30.8 v37,36.2 | v46.8,30.8 47,31 v47,35.2
  Bottom 0.254: v37,36.2 24.2,36.2 23.6,36.8 20,36.8 IC10.25 | v46.8,30.8 v37,30.8 | v47,35.2 59,35.2 60,34.2 61.8,34.2 IC3.9
N$27  (via drill 0.3)
  Top 0.254: v16.2,47.2 17.2,48.2 17.2,50.2 17.4,50.4 17.4,55.4 21,59 43,59 v43,57.6 | v46.6,57.6 46.6,53.2 46.8,53 v46.8,51.8 | v48.4,51.8 48.6,51.6 48.6,51.4 49.6,50.4 52.2,50.4 52.2,31.8 52.4,31.6 52.4,27.2 50.6,25.4 v50.6,21 | v69.8,21 69.8,30 v69.6,30.2
  Bottom 0.254: IC10.4 6.6,47 7,47.4 16,47.4 v16.2,47.2 | v43,57.6 43.2,57.8 46.4,57.8 v46.6,57.6 | v48.4,51.8 v46.8,51.8 | v69.8,21 v50.6,21 | v69.6,30.2 69.8,30.4 70.6,30.4 71.4,31.2 71.4,34.2 69.6,34.2 IC3.12
N$28
  Top 0.254: -------BELLATRIX.37 45,45 41.8,45 K1.37
N$29
  Bottom 0.254: K1.38 41.8,47.4 43.6,47.4 43.8,47.6 45,47.6 -------BELLATRIX.38
N$30
  Bottom 0.254: K1.16 26.6,14.4 28.4,14.4 28.6,14.6 29.8,14.6 -------BELLATRIX.16
N$31
  Top 0.254: -------BELLATRIX.17 29.8,12 26.6,12 K1.17
N$32
  Top 0.254: -------BELLATRIX.30 45,27.2 41.8,27.2 K1.30
N$33
  Top 0.254: -------BELLATRIX.18 29.8,9.4 26.6,9.4 K1.18
N$34
  Top 0.254: -------BELLATRIX.19 29.8,7 26.6,7 K1.19
N$35
  Bottom 0.254: K1.20 26.6,4.2 28.4,4.2 28.6,4.4 29.8,4.4 -------BELLATRIX.20
N$42  (via drill 0.3)
  Top 0.254: v67,41.8 67,43.6 66.6,44 66.6,48.6 66.8,48.8 66.8,50 v67,50.2 | v64.8,50.2 64.6,50 64.6,49 64.8,48.8 64.8,38.6 65,38.4 65,33.6 v64.8,33.4 | v63.4,30.4 63,30 63,28.8 62.4,28.2 v62.4,16 | v36,16.2 36,32 36.4,32.4 36.4,35.6 36.2,35.8 36.2,36.8 36.4,37 36.4,37.8 36,38.2 36,43.6 v36.2,43.8
  Bottom 0.254: v67,41.8 69.6,41.8 IC3.15 | v64.8,50.2 v67,50.2 | v64.8,33.4 64.8,31.4 63.8,30.4 v63.4,30.4 | v62.4,16 42.8,16 42.6,15.8 40.4,15.8 40,16.2 v36,16.2 | v36.2,43.8 22.4,43.8 21.8,44.4 20,44.4 IC10.28
N$43  (via drill 0.3)
  Top 0.254: v64,44.2 64.2,44.4 64.2,48.6 64,48.8 v64,58.8 | v48.6,58.8 48.6,58.4 48,57.8 48,57.4 v47.4,56.8 | v42.4,56.8 41.4,55.8 39.6,55.8 v39.6,56.6 | v32,56.4 31.2,55.6 29.4,55.6 v29.4,56.4 | v20.2,57 19.8,57 18,55.2 v18,49.8
  Bottom 0.254: v64,44.2 69.6,44.2 IC3.16 | v64,58.8 63.8,59 48.8,59 v48.6,58.8 | v47.4,56.8 47.2,56.6 42.6,56.6 v42.4,56.8 | v39.6,56.6 39.4,56.4 v32,56.4 | v29.4,56.4 29.2,56.2 25.4,56.2 25.2,56.4 24.4,56.4 23.8,57 v20.2,57 | v18,49.8 17.8,50 6.4,50 6,49.6 4.8,49.6 IC10.3
N$44  (via drill 0.3)
  Top 0.254: v32.4,51.2 32.6,51 32.6,50.6 33,50.2 33,39.2 32.6,38.8 v32.6,32.8 | v35.6,32.8 35.4,32.6 35.4,17.4 35,17 35,11 v35.2,10.8 | v69,11 69,20 68.6,20.4 68.6,29.2 v68.8,29.4 | v64.2,35.2 64.4,35.4 64.4,38.2 64.2,38.4 64.2,43 v64,43.2 | v66.2,43.2 66,43.4 66,48.8 66.2,49 v66.2,51.8
  Bottom 0.254: v32.4,51.2 22.6,51.2 21.8,52 20,52 IC10.31 | v35.6,32.8 v32.6,32.8 | v35.2,10.8 55.2,10.8 55.4,11 v69,11 | v68.8,29.4 70.8,29.4 72,30.6 72,35.2 v64.2,35.2 | v66.2,43.2 v64,43.2 | v66.2,51.8 69.6,51.8 IC3.19
N$45  (via drill 0.3)
  Top 0.254: v14.2,51.4 14.2,40.4 14,40.2 14,16 v14.2,15.8 | v18.2,15.8 18.4,15.6 18.4,11.2 v19.4,10.2 | v40,12.6 40.4,13 v43.6,13 | v51.4,22.2 v51.4,13
  Bottom 0.254: v14.2,51.4 14,51.2 7.4,51.2 6.6,52 4.8,52 IC10.2 | v18.2,15.8 v14.2,15.8 | v19.4,10.2 19.6,10.4 23,10.4 23.2,10.6 24.8,10.6 25,10.8 30.8,10.8 32.8,12.8 39.8,12.8 v40,12.6 | v51.4,13 v43.6,13 | v51.4,22.2 56.6,22.2 IC9.2
N$50  (via drill 0.3)
  Top 0.254: v32,48.6 32.4,48.2 32.4,39.4 32,39 32,33.4 31.8,33.2 v31.8,31.2 | v36.8,29.8 36.6,29.6 36.6,16.8 36.8,16.6 v36.8,3 | v52.8,3 52.8,9.8 53,10 53,14.4 v52.8,14.6
  Bottom 0.254: v32,48.6 20.8,48.6 20,49.4 IC10.30 | v31.8,31.2 32,31 35.6,31 v36.8,29.8 | v36.8,3 37,2.8 52.6,2.8 v52.8,3 | v52.8,14.6 56.6,14.6 IC9.5
N$51  (via drill 0.3)
  Top 0.254: v52.2,12 52.2,3.6 52,3.4 v52,1.4 | v16.2,2.8 16.2,5.6 16.4,5.8 16.4,9.2 16.2,9.4 16.2,14.2 16.6,14.6 v16.6,21.4 | v12,21.4 11.6,21.4 11.6,32.6 12.2,33.2 12.2,40 12,40.2 12,43.4 v11.8,43.6 | v7.6,43.6 7.8,43.8 7.8,52.4 7.4,52.8 v7.4,54.6
  Bottom 0.254: v52.2,12 56.6,12 IC9.6 | v52,1.4 51.8,1.6 34.6,1.6 33.6,2.6 31.8,2.6 31.4,2.2 23.2,2.2 22.8,2.6 21.6,2.6 21.4,2.8 18,2.8 17.8,2.6 17,2.6 16.8,2.8 v16.2,2.8 | v16.6,21.4 16.4,21.2 12.2,21.2 v12,21.4 | v11.8,43.6 11.6,43.8 7.8,43.8 v7.6,43.6 | v7.4,54.6 4.8,54.6 IC10.1
N$55
  Top 0.254: -------BELLATRIX.36 45,42.6 41.8,42.6 41.8,42.4 K1.36
N$59  (via drill 0.3)
  Top 0.254: v7.4,35 7.2,34.8 7.2,24.8 7.4,24.6 7.4,23.8 7.2,23.6 7.2,12.2 IC1.15
  Bottom 0.254: v7.4,35 7.6,35.2 17.8,35.2 18.6,34.4 19.8,34.4 IC10.24
N$64  (via drill 0.3)
  Top 0.254: v21.6,13.8 21.6,17 21,17.6 18.2,17.6 v18.2,17.2 | v6.4,17.4 6.6,17.2 6.6,13.6 6.2,13.2 6.2,8 4.6,6.4 4.6,4.6 IC1.1
  Bottom 0.254: v21.6,13.8 23.6,13.8 24,13.4 42.8,13.4 44,14.6 45,14.6 -------BELLATRIX.25 | v18.2,17.2 18,17.4 13,17.4 12.8,17.2 6.6,17.2 v6.4,17.4
N$68  (via drill 0.3)
  Top 0.254: v34,18 33.8,17.8 33.8,6.2 34.2,5.8 v34.2,4.2 | v32.1,4 31.4,3.6 31.4,3 31,2.6 v31,1.4 | v7.2,2.6 7.2,4.4 IC1.2
  Bottom 0.254: v34,18 42.8,18 43.8,17 45,17 -------BELLATRIX.26 | v34.2,4.2 34,4 v32.1,4 | v31,1.4 30.8,1.6 23,1.6 22.6,2 21.4,2 21.2,2.2 18.2,2.2 18,2 15.8,2 15.2,2.6 v7.2,2.6
N$70  (via drill 0.3)
  Top 0.254: v33.4,21 33.2,20.8 33.2,5.6 v33.4,5.4 | v9.8,6.8 9.8,4.6 IC1.3
  Bottom 0.254: v33.4,21 42.4,21 43.8,19.6 45,19.6 -------BELLATRIX.27 | v33.4,5.4 33.2,5.6 32.6,5.6 32.4,5.8 25.4,5.8 24.4,6.8 v9.8,6.8
RX-H1
  Top 0.254: -------BELLATRIX.40 45,52.6 41.8,52.6 K1.40
TX-H1
  Top 0.254: -------BELLATRIX.39 45,50.2 41.8,50.2 K1.39
VDD  (via drill 0.61)
  Top 0.635: v39.4,24.6 39.4,30.8 40.2,31.6 40.2,31.8 40.8,32.4 41.6,32.4 K1.32 | IC9.20 64.2,24.8 64.2,28 C3.1 | IC2.20 57.8,54.6 57.8,56 58,56.2 58,57.6 C5.1 | IC3.20 v69.6,56 69.6,57.6 C2.1 | v71.6,28.4 71.8,28.6 71.8,57.6 v71.6,57.8 | v25.6,57.4 22.6,57.4 20,54.8 IC10.32 | v17.4,9.8 17.4,7.6 | 17.4,7.6 17.4,4.6 IC1.6 | v4.6,9.8 4.6,12 IC1.16 4.6,12.2 v4.6,14.2 | v9.4,54.4 9.4,36.2 9.2,36 9.2,32.4 9.4,32.2 9.4,21.2 8.2,20 8.2,14.4 v8.4,14.2 | v24.2,24.6 24.2,11.2 20.6,7.6 17.4,7.6
  Bottom 0.635: K1.32 41.8,32.2 45,32.2 -------BELLATRIX.32 45.4,32.2 47,32.2 49.6,29.6 50.4,29.6 50.6,29.4 55.8,29.4 56,29.6 57,29.6 57.2,29.4 61.6,29.4 61.8,29.6 62.4,29.6 63.6,28.4 63.6,28.2 63.8,28.2 C3.1 64.2,28.2 69.2,28.2 69.4,28.4 v71.6,28.4 | v39.4,24.6 30,24.6 -------BELLATRIX.12 29.8,24.6 26.6,24.6 K1.12 26.2,24.6 v24.2,24.6 | C5.1 60,57.6 61.6,56 v69.6,56 | v71.6,57.8 69.8,57.8 C2.1 | v25.6,57.4 25.8,57.6 30.2,57.6 30.4,57.4 30.8,57.4 R1.2 | C1.1 16.2,57.8 19.4,54.6 19.8,54.6 IC10.32 19.2,54.4 v9.4,54.4 | IC1.16 4.6,12 1.6,12 C4.1 | v4.6,9.8 v17.4,9.8 | v4.6,14.2 v8.4,14.2
VSS  (via drill 0.61)
  Top 0.635: -------BELLATRIX.10 29.8,29.8 29.8,32.2 -------BELLATRIX.9 | K1.9 26.4,32.2 26.4,29.8 K1.10 | v50.2,28.2 50.2,31.4 IC2.10 | IC9.1 56.6,24.8 56.6,26.6 56.4,26.8 56.4,28 C3.2 | v32.2,22.4 v32.2,29.8 | v39.4,22.2 39.8,22.6 39.8,22.8 40.8,23.8 41.8,23.8 41.8,24.6 K1.29 | C2.2 62,57.6 62,54.6 IC3.1 61.8,54.2 60,52.4 v60,30.8 | v60.8,1.8 61.2,2.2 61.2,16.4 61.4,16.6 61.4,28 | 61.4,28 61.4,28.4 62,29 62,31.4 IC3.10 | v61.2,28 61.4,28 | IC2.1 50.2,54.6 50.2,57.6 C5.2 | 4.8,16.6 IC10.16 | v15.2,25.2 15,25 15,19.6 v15.2,19.4 | v9.6,19.4 9.4,19.2 9.4,16.2 v9.6,16
  Bottom 0.635: K1.10 26.4,29.6 24.4,29.6 24,29.2 20,29.2 IC10.22 19.6,29.2 19,29.2 16.2,26.4 16.2,25.2 v15.2,25.2 | -------BELLATRIX.9 29.8,32.2 26.6,32.2 K1.9 | K1.29 41.8,24.6 45,24.6 -------BELLATRIX.29 45.4,24.6 54.6,24.6 54.8,24.8 56.6,24.8 IC9.1 | v50.2,28.2 56.4,28.2 C3.2 56.8,28.2 61,28.2 v61.2,28 | v32.2,29.8 30,29.8 -------BELLATRIX.10 | v32.2,22.4 32.4,22.6 38.6,22.6 38.8,22.4 39.2,22.4 v39.4,22.2 | v60.8,1.8 56.8,1.8 IC9.10 | v60,30.8 60.8,31.6 61.8,31.6 IC3.10 | v15.2,19.4 15,19.6 11,19.6 10.8,19.4 v9.6,19.4 | v9.6,16 9.4,16.2 6,16.2 5.6,16.6 4.8,16.6 IC10.16
  pour Bottom: 1,59 72,59 72,1 1,1
  pour Top: 1,59 72,59 72,1 1,1
WR
  Bottom 0.254: K1.35 41.8,39.8 43.6,39.8 43.8,40 45,40 -------BELLATRIX.35